# EAGLE schematic 1300XX_3HP_Upgrades (EAGLE 6.5.0)

## Sheet 1 of 4
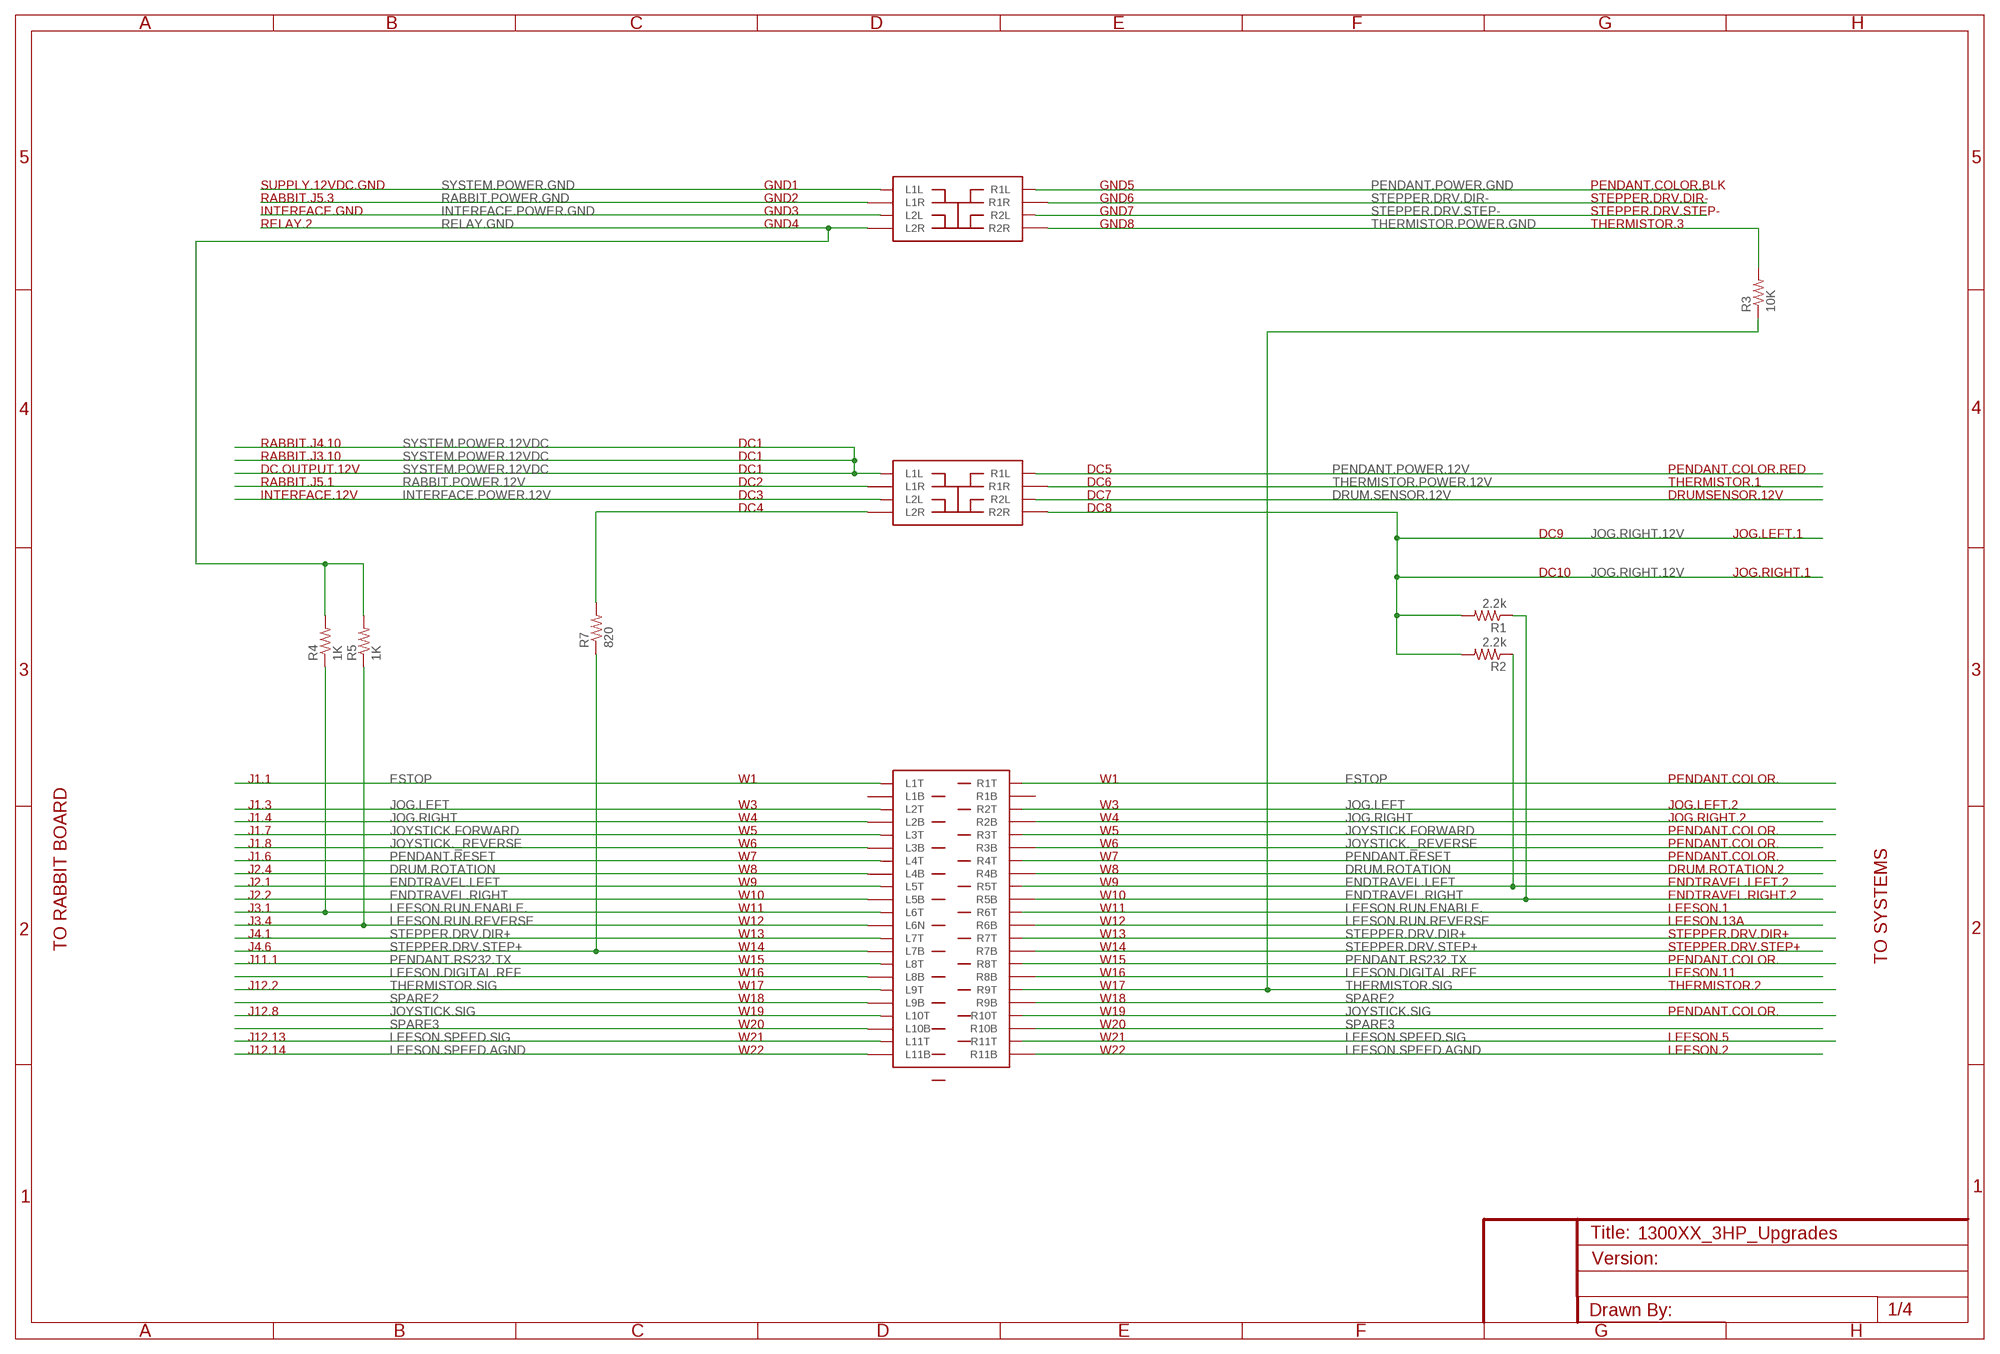
[diagram p0: schematic, sheet 1]

### Parts
R1  2.2k  R-US_V234/12  [V234/12]
R2  2.2k  R-US_V234/12  [V234/12]
R3  10K  R-US_V234/12  [V234/12]
R4  1K  R-US_V234/12  [V234/12]
R5  1K  R-US_V234/12  [V234/12]
R7  820  R-US_V234/12  [V234/12]
U$1  TB_3031160_11POS_DUAL_2  [BOGUS]
U$2  TB_3XXXXXX_4X_2POS  [BOGUS]
U$3  TB_3XXXXXX_4X_2POS  [BOGUS]

### Nets
DRUM.ROTATION: U$1.P$7(L4B) U$1.P$29(R4B)
DRUM.SENSOR.12V: U$2.P$7(R2L)
ENDTRAVEL.LEFT: R2.1 U$1.P$10(L5T) U$1.P$32(R5T)
ENDTRAVEL.RIGHT: R1.1 U$1.P$9(L5B) U$1.P$31(R5B)
ESTOP: U$1.P$2(L1T) U$1.P$24(R1T)
INTERFACE.POWER.12V: U$2.P$3(L2L)
INTERFACE.POWER.GND: U$3.P$3(L2L)
JOG.LEFT: U$1.P$4(L2T) U$1.P$26(R2T)
JOG.RIGHT: U$1.P$3(L2B) U$1.P$25(R2B)
JOG.RIGHT.12V: R1.2 R2.2 U$2.P$8(R2R)
JOYSTICK._REVERSE: U$1.P$5(L3B) U$1.P$27(R3B)
JOYSTICK.FORWARD: U$1.P$6(L3T) U$1.P$28(R3T)
JOYSTICK.SIG: U$1.P$20(L10T) U$1.P$42(R10T)
LEESON.DIGITAL.REF: U$1.P$15(L8B) U$1.P$37(R8B)
LEESON.PULLUPS.12V: R7.2 U$2.P$4(L2R)
LEESON.RUN.ENABLE.: R4.1 U$1.P$12(L6T) U$1.P$34(R6T)
LEESON.RUN.REVERSE: R5.1 U$1.P$11(L6N) U$1.P$33(R6B)
LEESON.SPEED.AGND: U$1.P$21(L11B) U$1.P$43(R11B)
LEESON.SPEED.SIG: U$1.P$22(L11T) U$1.P$44(R11T)
PENDANT.POWER.12V: U$2.P$5(R1L)
PENDANT.POWER.GND: U$3.P$5(R1L)
PENDANT.RESET: U$1.P$8(L4T) U$1.P$30(R4T)
PENDANT.RS232.TX: U$1.P$16(L8T) U$1.P$38(R8T)
RABBIT.POWER.12V: U$2.P$2(L1R)
RABBIT.POWER.GND: U$3.P$2(L1R)
RELAY.GND: R4.2 R5.2 U$3.P$4(L2R)
SPARE2: U$1.P$17(L9B) U$1.P$39(R9B)
SPARE3: U$1.P$19(L10B) U$1.P$41(R10B)
STEPPER.DRV.DIR+: U$1.P$14(L7T) U$1.P$36(R7T)
STEPPER.DRV.DIR-: U$3.P$6(R1R)
STEPPER.DRV.STEP+: R7.1 U$1.P$13(L7B) U$1.P$35(R7B)
STEPPER.DRV.STEP-: U$3.P$7(R2L)
SYSTEM.POWER.12VDC: U$2.P$1(L1L)
SYSTEM.POWER.GND: U$3.P$1(L1L)
THERMISTOR.POWER.12V: U$2.P$6(R1R)
THERMISTOR.POWER.GND: R3.2 U$3.P$8(R2R)
THERMISTOR.SIG: R3.1 U$1.P$18(L9T) U$1.P$40(R9T)
Unconnected: U$1.P$1(L1B) U$1.P$23(R1B)

### Notes on the sheet
- SUPPLY.12VDC.GND | GND1 | GND5 | PENDANT.COLOR.BLK
- RABBIT.J5.3 | GND2 | GND6 | STEPPER.DRV.DIR-
- INTERFACE.GND | GND3 | GND7 | STEPPER.DRV.STEP-
- RELAY.2 | GND4 | GND8 | THERMISTOR.3
- RABBIT.J4.10 | DC1
- RABBIT.J3.10 | DC1
- DC.OUTPUT.12V | DC1 | DC5 | PENDANT.COLOR.RED
- RABBIT.J5.1 | DC2 | DC6 | THERMISTOR.1
- INTERFACE.12V | DC3 | DC7 | DRUMSENSOR.12V
- DC4 | DC8
- DC9 | JOG.LEFT.1
- DC10 | JOG.RIGHT.1
- J1.1 | W1 | W1 | PENDANT.COLOR.
- J1.3 | W3 | W3 | JOG.LEFT.2
- J1.4 | W4 | W4 | JOG.RIGHT.2
- J1.7 | W5 | W5 | PENDANT.COLOR.
- J1.8 | W6 | W6 | PENDANT.COLOR.
- J1.6 | W7 | W7 | PENDANT.COLOR.
- J2.4 | W8 | W8 | DRUM.ROTATION.2
- J2.1 | W9 | W9 | ENDTRAVEL.LEFT.2
- J2.2 | W10 | W10 | ENDTRAVEL.RIGHT.2
- J3.1 | W11 | W11 | LEESON.1
- J3.4 | W12 | W12 | LEESON.13A
- J4.1 | W13 | W13 | STEPPER.DRV.DIR+
- TO RABBIT BOARD | J4.6 | W14 | W14 | STEPPER.DRV.STEP+
- J11.1 | W15 | W15 | PENDANT.COLOR. | TO SYSTEMS
- W16 | W16 | LEESON.11
- J12.2 | W17 | W17 | THERMISTOR.2
- W18 | W18
- J12.8 | W19 | W19 | PENDANT.COLOR.
- W20 | W20
- J12.13 | W21 | W21 | LEESON.5
- J12.14 | W22 | W22 | LEESON.2

## Sheet 2 of 4
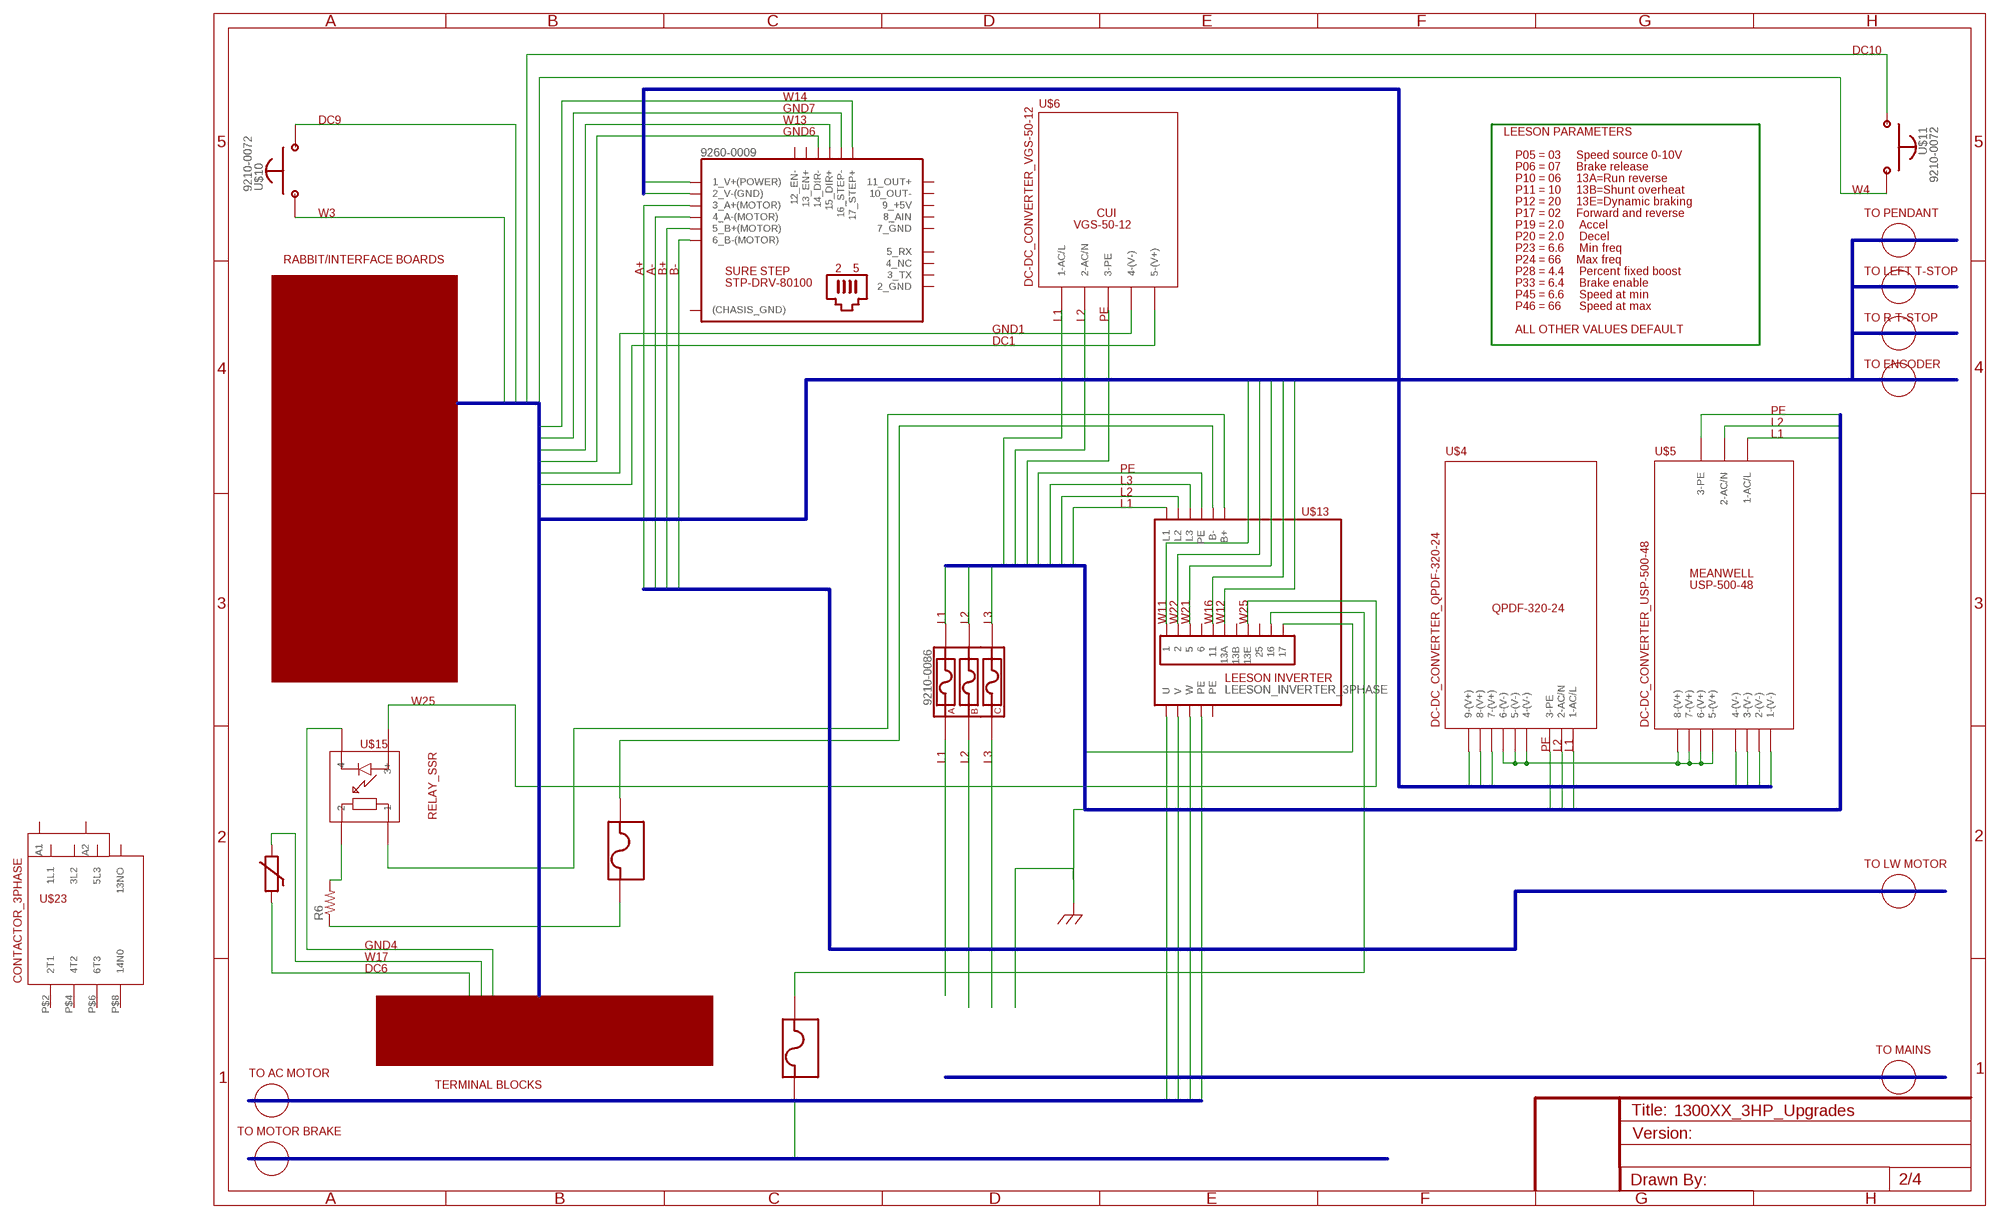
[diagram p1: schematic, sheet 2]

### Parts
PE1  GND_CHASSIS  [BOGUS]
R6  R-US_V234/12  [V234/12]
U$4  DC-DC_CONVERTER_QPDF-320-24  [BOGUS]
U$5  DC-DC_CONVERTER_USP-500-48  [BOGUS]
U$6  DC-DC_CONVERTER_VGS-50-12  [BOGUS]
U$7  THERMISTOR  [BOGUS]
U$8  TERMINAL_BLOCK_FUSED  [BOGUS]
U$9  TERMINAL_BLOCK_FUSED  [BOGUS]
U$10  SWITCH_MOM_NO  [BOGUS]
U$11  SWITCH_MOM_NO  [BOGUS]
U$12  SURE_STEP_STP-DRV-80100  [BOGUS]
U$13  LEESON_INVERTER_3PHASE  [BOGUS]
U$14  FUSE_HOLDER_3-POLE  [BOGUS]
U$15  RELAY_SSR  [BOGUS]
U$23  CONTACTOR_3PHASE  [BOGUS]

### Nets
B$1: PE1.P$1(PE) U$14.P$1 U$14.P$2 U$14.P$5 ; also sheet 4
B$2: U$13.P$18(PE) U$13.P$20(U) U$13.P$21(V) U$13.P$22(W)
B$3: U$8.P$1
B$4: U$4.P$1(1-AC/L) U$4.P$2(2-AC/N) U$4.P$3(3-PE) U$5.P$2(1-AC/L) U$5.P$4(2-AC/N) U$5.P$6(3-PE) U$6.P$1(1-AC/L) U$6.P$2(2-AC/N) U$6.P$3(3-PE) U$13.P$10 U$13.P$14(L1) U$13.P$15(L2) U$13.P$16(L3) U$13.P$17(PE) U$14.P$3 U$14.P$4 U$14.P$6
B$5: U$4.P$7(7-(V+)) U$4.P$8(8-(V+)) U$4.P$9(9-(V+)) U$5.P$1(1-(V-)) U$5.P$3(2-(V-)) U$5.P$5(3-(V-)) U$5.P$7(4-(V-)) U$12.P$2(1_V+(POWER)) U$12.P$3(2_V-(GND))
B$6: U$6.P$4(4-(V-)) U$6.P$5(5-(V+)) U$10.P$1 U$10.P$2 U$11.P$2 U$12.P$15(14_DIR-) U$12.P$16(15_DIR+) U$12.P$17(16_STEP-) U$12.P$18(17_STEP+) U$13.P$1 U$13.P$2 U$13.P$3 U$13.P$5 U$13.P$6(13A)
B$7: U$12.P$4(3_A+(MOTOR)) U$12.P$5(4_A-(MOTOR)) U$12.P$6(5_B+(MOTOR)) U$12.P$7(6_B-(MOTOR))
N$1: U$4.P$4(4-(V-)) U$4.P$5(5-(V-)) U$4.P$6(6-(V-)) U$5.P$8(5-(V+)) U$5.P$9(6-(V+)) U$5.P$10(7-(V+)) U$5.P$11(8-(V+))
N$2: U$9.P$2 U$13.P$13(B-)
N$3: U$13.P$12(B+) U$15.P$1
N$5: R6.2 U$15.P$2
N$6: R6.1 U$9.P$1
N$7: U$13.P$8(13E) U$15.P$3(3+)
N$8: U$8.P$2 U$13.P$9
N$9: U$15.P$4
N$10: U$7.P$1
N$11: U$7.P$2
Unconnected: U$11.P$1 U$13.P$4 U$13.P$7(13B) U$13.P$11 U$23.P$1(1L1) U$23.P$2(2T1) U$23.P$3(3L2) U$23.P$4(4T2) U$23.P$5(5L3) U$23.P$6(6T3) U$23.P$7(13NO) U$23.P$8(14N0) U$23.P$9(A1) U$23.P$10(A2)

### Buses
B$1
B$2
B$3
B$4
B$5
B$6
B$7

### Notes on the sheet
- DC10
- W14
- GND7
- DC9 | W13
- GND6 | LEESON PARAMETERS
- P05 = 03     Speed source 0-10V
- P06 = 07     Brake release
- P10 = 06     13A=Run reverse
- P11 = 10     13B=Shunt overheat | W4
- P12 = 20     13E=Dynamic braking
- W3 | P17 = 02     Forward and reverse | TO PENDANT
- P19 = 2.0     Accel
- P20 = 2.0     Decel
- P23 = 6.6     Min freq
- RABBIT/INTERFACE BOARDS | P24 = 66     Max freq
- A+ | A- | B+ | B- | P28 = 4.4     Percent fixed boost | TO LEFT T-STOP
- P33 = 6.4     Brake enable
- P45 = 6.6     Speed at min
- P46 = 66      Speed at max
- L1 | L2 | PE | TO R T-STOP
- GND1 | ALL OTHER VALUES DEFAULT
- DC1
- TO ENCODER
- PE
- L2
- L1
- PE
- L3
- L2
- L1
- L1 | L2 | L3 | W11 | W22 | W21 | W16 | W12 | W25
- W25
- PE | L2 | L1
- L1 | L2 | L3
- TO LW MOTOR
- GND4
- W17
- DC6
- TO MAINS
- TO AC MOTOR
- TERMINAL BLOCKS
- TO MOTOR BRAKE

## Sheet 3 of 4
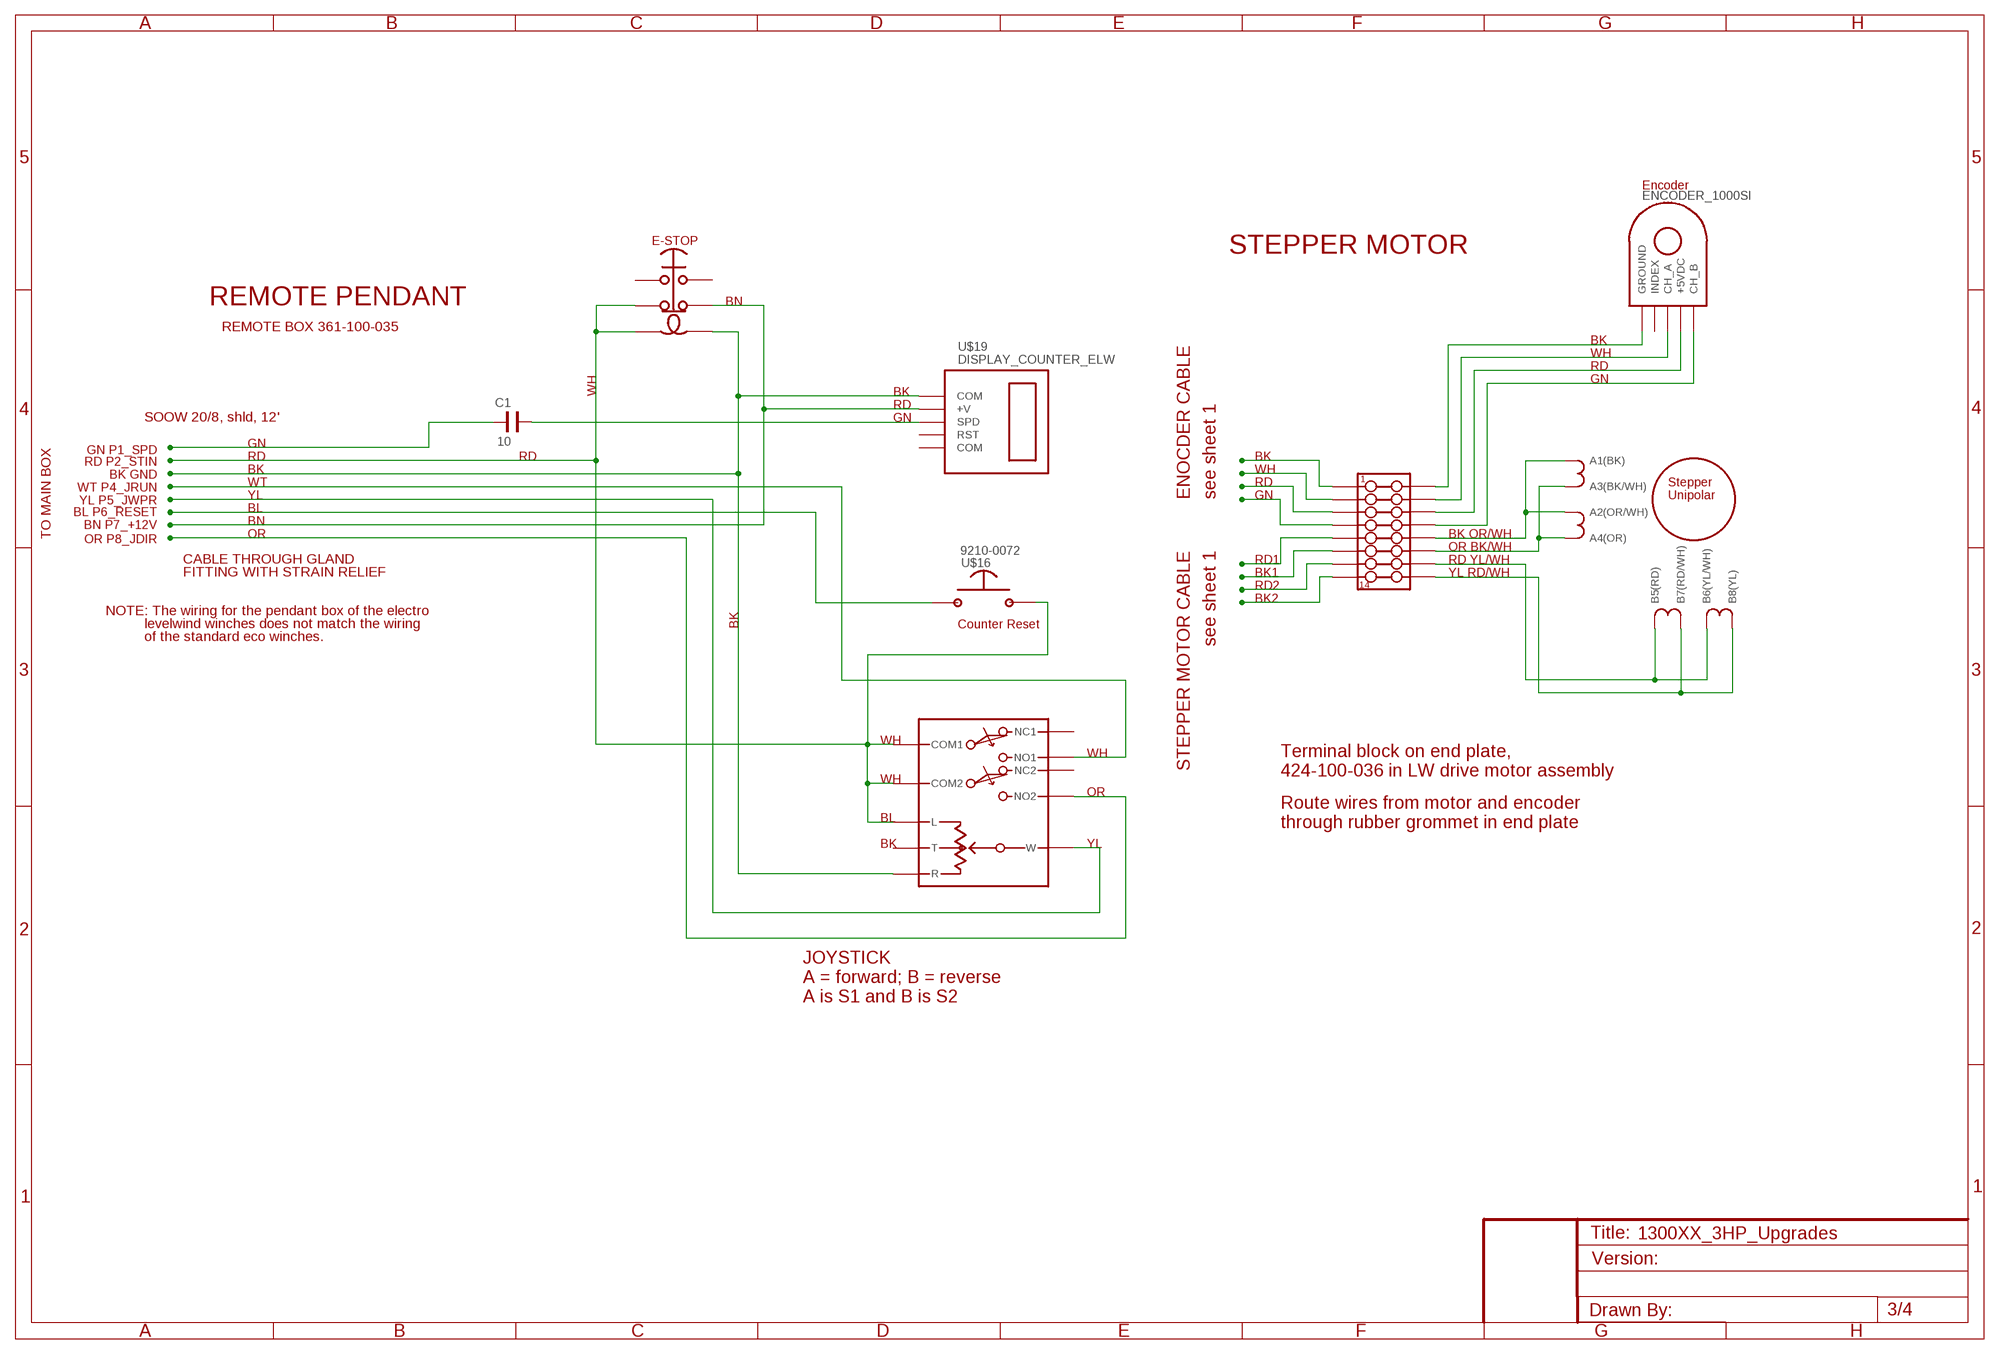
[diagram p2: schematic, sheet 3]

### Parts
C1  10  C0805  [R0805]
U$16  Counter Reset  SWITCH_MOM_NO  [BOGUS]
U$17  SWITCH_ESTOP_LIGHTED  [BOGUS]
U$18  JOYSTICK_PRO-5  [BOGUS]
U$19  DISPLAY_COUNTER_ELW  [BOGUS]
U$20  TERMINAL_BLOCK_8  [BOGUS]
U$21  MOTOR_STEPPER_UNIPOLAR  [BOGUS]
U$22  ENCODER_1000SI  [BOGUS]

### Nets
N$4: U$17.P$6 U$18.P$8(R) U$19.P$2(COM)
N$23: C1.2 U$19.P$5(SPD)
N$69: C1.1
N$72: U$18.P$6(NO1)
N$73: U$18.P$10(W)
N$75: U$17.P$4 U$19.P$1(+V)
N$76: U$18.P$7(NO2)
N$77: U$16.P$1
N$78: U$16.P$2 U$17.P$2 U$17.P$5 U$18.P$1(COM1) U$18.P$2(COM2) U$18.P$3(L)
N$81: U$20.P$12 U$21.P$1(A1(BK)) U$21.P$2(A2(OR/WH))
N$88: U$20.P$11 U$21.P$3(A3(BK/WH)) U$21.P$4(A4(OR))
N$89: U$20.P$9 U$21.P$7(B7(RD/WH)) U$21.P$8(B8(YL))
N$91: U$20.P$10 U$21.P$5(B5(RD)) U$21.P$6(B6(YL/WH))
N$92: U$20.P$16 U$22.P$4(GROUND)
N$93: U$20.P$15 U$22.P$2(CH_A)
N$94: U$20.P$14 U$22.P$1(+5VDC)
N$95: U$20.P$13 U$22.P$3(CH_B)
N$96: U$20.P$1
N$97: U$20.P$2
N$98: U$20.P$3
N$99: U$20.P$4
N$100: U$20.P$8
N$101: U$20.P$7
N$102: U$20.P$6
N$103: U$20.P$5
Unconnected: U$17.P$1 U$17.P$3 U$18.P$4(NC1) U$18.P$5(NC2) U$18.P$9(T) U$19.P$3(COM) U$19.P$4(RST) U$22.P$5(INDEX)

### Notes on the sheet
- STEPPER MOTOR
- REMOTE PENDANT | BN
- REMOTE BOX 361-100-035
- BK
- WH
- RD
- GN
- WH | BK
- RD
- SOOW 20/8, shld, 12' | GN
- TO MAIN BOX | GN P1_SPD | GN
- RD P2_STIN
- RD | RD | BK
- BK GND
- BK | WH
- WT P4_JRUN
- WT | RD
- YL P5_JWPR
- YL | ENOCDER CABLE | see sheet 1 | GN
- BL P6_RESET
- BL
- BN P7_+12V
- BN
- OR P8_JDIR
- OR | BK OR/WH
- STEPPER MOTOR CABLE | see sheet 1 | OR BK/WH
- CABLE THROUGH GLAND | RD1 | RD YL/WH
- FITTING WITH STRAIN RELIEF | BK1 | YL RD/WH
- RD2
- BK2
- NOTE: The wiring for the pendant box of the electro
- levelwind winches does not match the wiring | BK | Counter Reset
- of the standard eco winches.
- WH
- WH | Terminal block on end plate,
- 424-100-036 in LW drive motor assembly
- WH
- OR
- Route wires from motor and encoder
- BL
- through rubber grommet in end plate
- BK | YL
- JOYSTICK
- A = forward; B = reverse
- A is S1 and B is S2

## Sheet 4 of 4
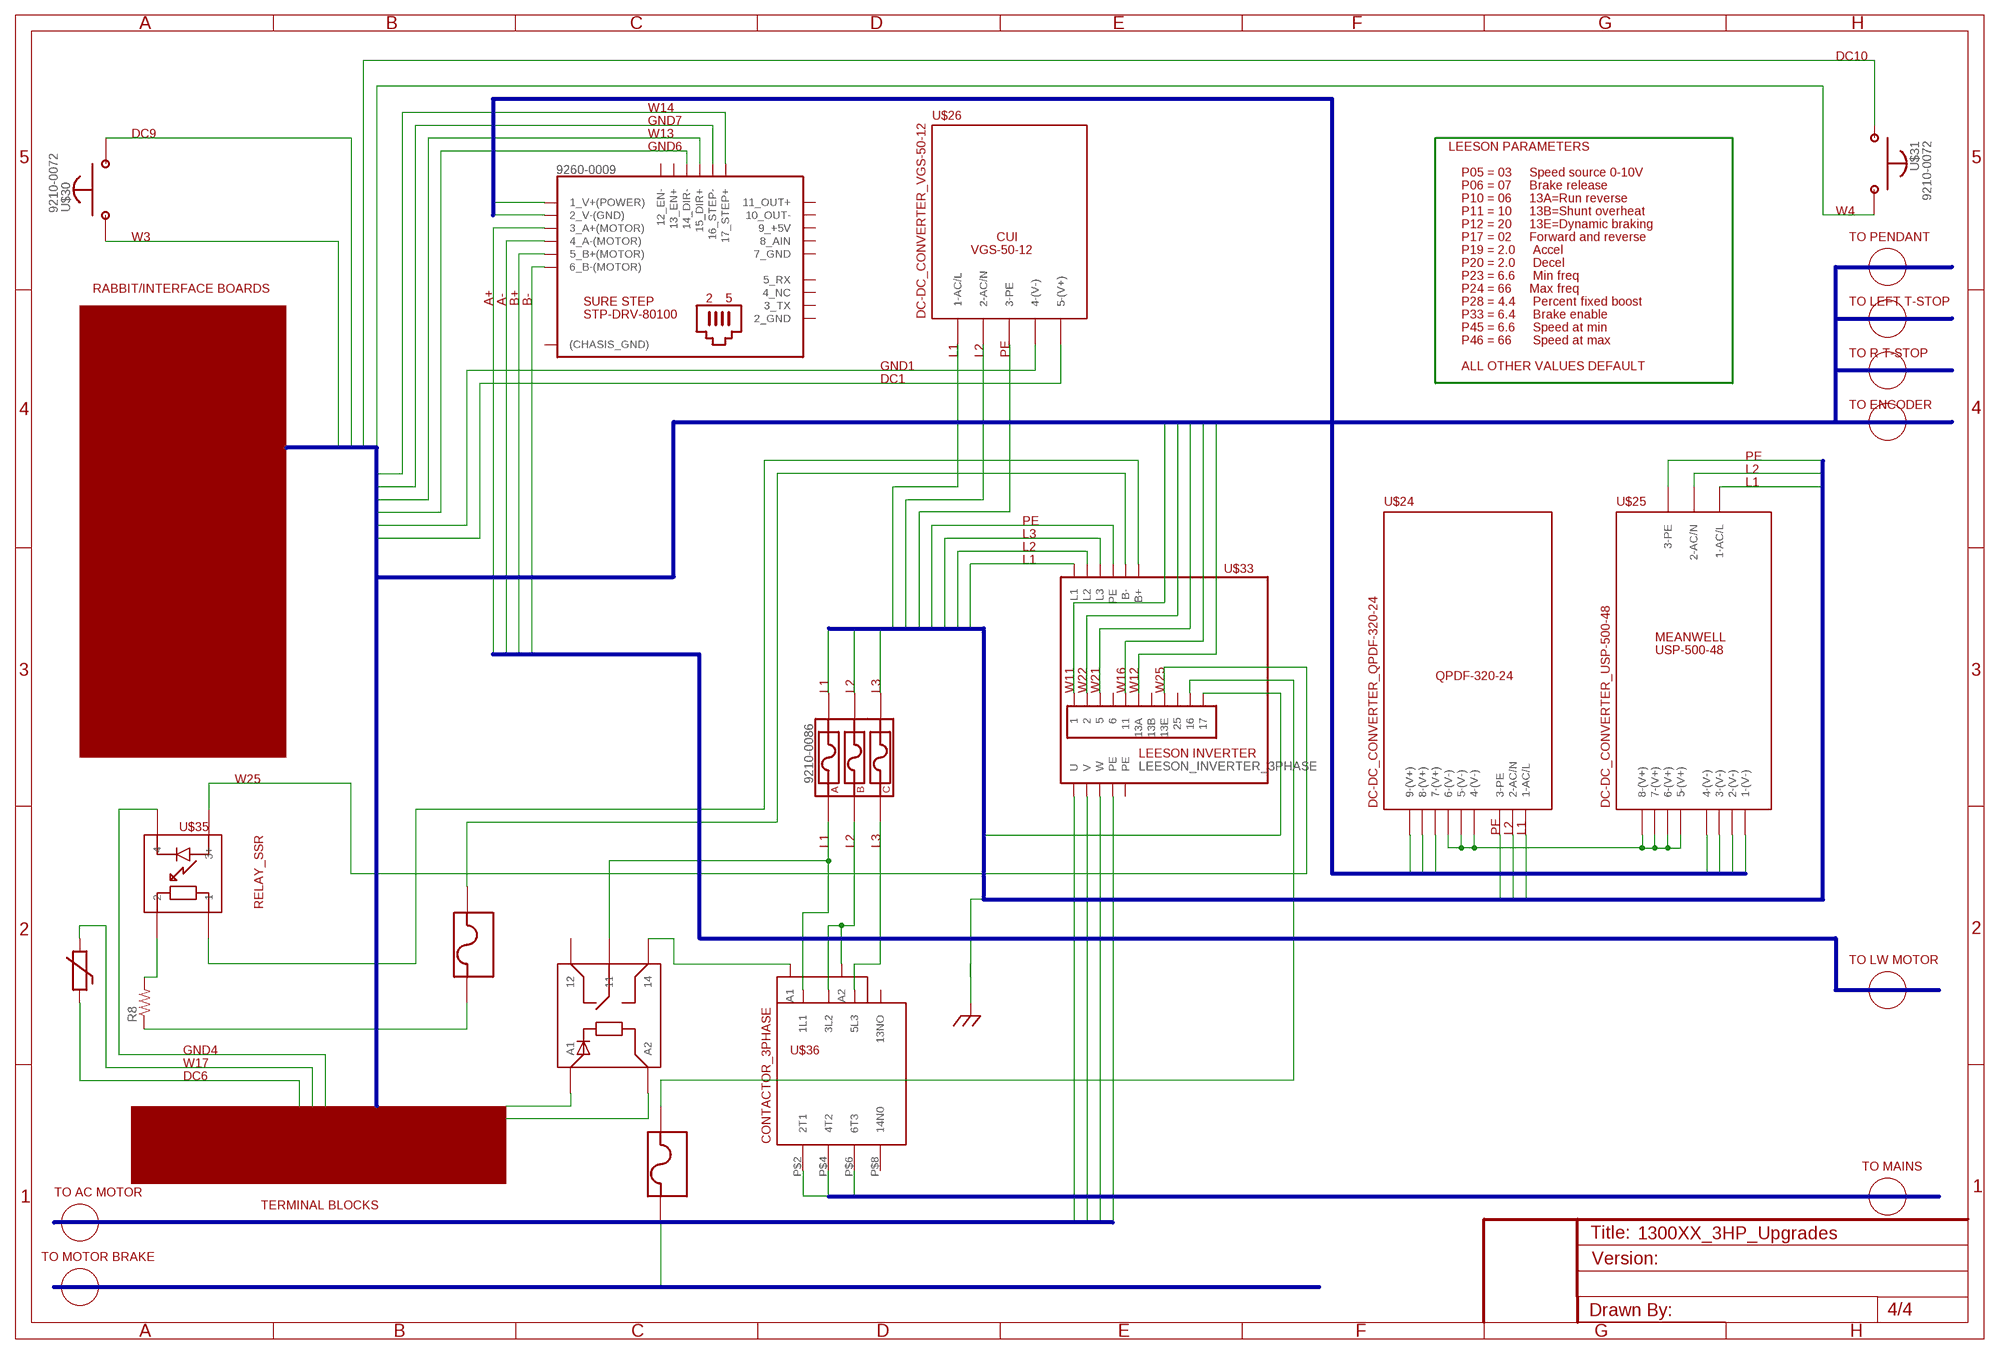
[diagram p3: schematic, sheet 4]

### Parts
PE2  GND_CHASSIS  [BOGUS]
R8  R-US_V234/12  [V234/12]
U$24  DC-DC_CONVERTER_QPDF-320-24  [BOGUS]
U$25  DC-DC_CONVERTER_USP-500-48  [BOGUS]
U$26  DC-DC_CONVERTER_VGS-50-12  [BOGUS]
U$27  THERMISTOR  [BOGUS]
U$28  TERMINAL_BLOCK_FUSED  [BOGUS]
U$29  TERMINAL_BLOCK_FUSED  [BOGUS]
U$30  SWITCH_MOM_NO  [BOGUS]
U$31  SWITCH_MOM_NO  [BOGUS]
U$32  SURE_STEP_STP-DRV-80100  [BOGUS]
U$33  LEESON_INVERTER_3PHASE  [BOGUS]
U$34  FUSE_HOLDER_3-POLE  [BOGUS]
U$35  RELAY_SSR  [BOGUS]
U$36  CONTACTOR_3PHASE  [BOGUS]
U$37  RELAY_TB  [BOGUS]

### Nets
B$1: PE2.P$1(PE) U$36.P$2(2T1) U$36.P$4(4T2) U$36.P$6(6T3) ; also sheet 2
B$8: U$33.P$18(PE) U$33.P$20(U) U$33.P$21(V) U$33.P$22(W)
B$9: U$24.P$1(1-AC/L) U$24.P$2(2-AC/N) U$24.P$3(3-PE) U$25.P$2(1-AC/L) U$25.P$4(2-AC/N) U$25.P$6(3-PE) U$26.P$1(1-AC/L) U$26.P$2(2-AC/N) U$26.P$3(3-PE) U$33.P$10 U$33.P$14(L1) U$33.P$15(L2) U$33.P$16(L3) U$33.P$17(PE) U$34.P$3 U$34.P$4 U$34.P$6
B$10: U$24.P$7(7-(V+)) U$24.P$8(8-(V+)) U$24.P$9(9-(V+)) U$25.P$1(1-(V-)) U$25.P$3(2-(V-)) U$25.P$5(3-(V-)) U$25.P$7(4-(V-)) U$32.P$2(1_V+(POWER)) U$32.P$3(2_V-(GND))
B$11: U$26.P$4(4-(V-)) U$26.P$5(5-(V+)) U$30.P$1 U$30.P$2 U$31.P$2 U$32.P$15(14_DIR-) U$32.P$16(15_DIR+) U$32.P$17(16_STEP-) U$32.P$18(17_STEP+) U$33.P$1 U$33.P$2 U$33.P$3 U$33.P$5 U$33.P$6(13A)
B$12: U$28.P$1
B$13: U$32.P$4(3_A+(MOTOR)) U$32.P$5(4_A-(MOTOR)) U$32.P$6(5_B+(MOTOR)) U$32.P$7(6_B-(MOTOR))
N$12: U$24.P$4(4-(V-)) U$24.P$5(5-(V-)) U$24.P$6(6-(V-)) U$25.P$8(5-(V+)) U$25.P$9(6-(V+)) U$25.P$10(7-(V+)) U$25.P$11(8-(V+))
N$13: U$29.P$2 U$33.P$13(B-)
N$14: U$33.P$12(B+) U$35.P$1
N$15: R8.2 U$35.P$2
N$16: R8.1 U$29.P$1
N$17: U$28.P$2 U$33.P$9
N$18: U$33.P$8(13E) U$35.P$3(3+)
N$19: U$35.P$4
N$20: U$27.P$1
N$21: U$27.P$2
N$25: U$34.P$5 U$36.P$5(5L3)
N$26: U$34.P$1 U$36.P$3(3L2) U$36.P$10(A2)
N$27: U$34.P$2 U$36.P$1(1L1) U$37.P$1
N$28: U$37.P$5(A2)
N$29: U$37.P$4(A1)
N$30: U$36.P$9(A1) U$37.P$3
Unconnected: U$31.P$1 U$33.P$4 U$33.P$7(13B) U$33.P$11 U$36.P$7(13NO) U$36.P$8(14N0) U$37.P$2

### Buses
B$1
B$2
B$3
B$4
B$5
B$6
B$7

### Notes on the sheet
- DC10
- W14
- GND7
- DC9 | W13
- GND6 | LEESON PARAMETERS
- P05 = 03     Speed source 0-10V
- P06 = 07     Brake release
- P10 = 06     13A=Run reverse
- P11 = 10     13B=Shunt overheat | W4
- P12 = 20     13E=Dynamic braking
- W3 | P17 = 02     Forward and reverse | TO PENDANT
- P19 = 2.0     Accel
- P20 = 2.0     Decel
- P23 = 6.6     Min freq
- RABBIT/INTERFACE BOARDS | P24 = 66     Max freq
- A+ | A- | B+ | B- | P28 = 4.4     Percent fixed boost | TO LEFT T-STOP
- P33 = 6.4     Brake enable
- P45 = 6.6     Speed at min
- P46 = 66      Speed at max
- L1 | L2 | PE | TO R T-STOP
- GND1 | ALL OTHER VALUES DEFAULT
- DC1
- TO ENCODER
- PE
- L2
- L1
- PE
- L3
- L2
- L1
- L1 | L2 | L3 | W11 | W22 | W21 | W16 | W12 | W25
- W25
- PE | L2 | L1
- L1 | L2 | L3
- TO LW MOTOR
- GND4
- W17
- DC6
- TO MAINS
- TO AC MOTOR
- TERMINAL BLOCKS
- TO MOTOR BRAKE

## Power pins joined to a net without a drawn wire
2_GND: U$12.P$19(2_GND) U$32.P$19(2_GND)
3_TX: U$12.P$20(3_TX) U$32.P$20(3_TX)
4_NC: U$12.P$21(4_NC) U$32.P$21(4_NC)
5_RX: U$12.P$22(5_RX) U$32.P$22(5_RX)
7_GND: U$12.P$8(7_GND) U$32.P$8(7_GND)
8_AIN: U$12.P$9(8_AIN) U$32.P$9(8_AIN)
9_+5V: U$12.P$10(9_+5V) U$32.P$10(9_+5V)
10_OUT-: U$12.P$11(10_OUT-) U$32.P$11(10_OUT-)
11_OUT+: U$12.P$12(11_OUT+) U$32.P$12(11_OUT+)
12_EN-: U$12.P$13(12_EN-) U$32.P$13(12_EN-)
13_EN+: U$12.P$14(13_EN+) U$32.P$14(13_EN+)
(CHASIS_GND): U$12.P$1((CHASIS_GND)) U$32.P$1((CHASIS_GND))
PE: U$13.P$19(PE) U$33.P$19(PE)

## Library data of the parts
C1 = SOSI:C0805; DPN: 10009
PE1 PE2 = DougM-SOSI-Wiring-Diagram.rpt:GND_CHASSIS: SUPPLY SYMBOL
R1-R5 R7 = rcl:R-US_: RESISTOR, American symbol
R6 R8 = resistor:R-US_: RESISTOR, American symbol
U$1 = SOSI-TerminalBlocks:TB_3031160_11POS_DUAL_2
U$2 U$3 = SOSI-TerminalBlocks:TB_3XXXXXX_4X_2POS
U$4 U$24 = DougM-SOSI-Wiring-Diagram.rpt:DC-DC_CONVERTER_QPDF-320-24
U$5 U$25 = DougM-SOSI-Wiring-Diagram.rpt:DC-DC_CONVERTER_USP-500-48
U$6 U$26 = DougM-SOSI-Wiring-Diagram.rpt:DC-DC_CONVERTER_VGS-50-12
U$7 U$27 = DougM-SOSI-Wiring-Diagram.rpt:THERMISTOR: (no PN available) (no description available) Soundnine Inc. (no vendor PN available)
U$8 U$9 U$28 U$29 = DougM-SOSI-Wiring-Diagram.rpt:TERMINAL_BLOCK_FUSED: 9210-0372 7641K943 Modular DIN Rail-Mount Terminal Block DIN 1 & 3, w/ Blown Fuse Indicator, 8mm, 24 VDC McMasterr McMaster 7641K943
U$10 U$11 U$30 U$31 = DougM-SOSI-Wiring-Diagram.rpt:SWITCH_MOM_NO: 9210-0072 Mouser Part #: 850-59-313 Manufacturer Part #: 59-313
U$12 U$32 = DougM-SOSI-Wiring-Diagram.rpt:SURE_STEP_STP-DRV-80100: 9260-0009 STP-DRV-80100 Step Motor Driver, 80 V 10A Sure Step Automation Direct
U$13 U$33 = DougM-SOSI-Wiring-Diagram.rpt:LEESON_INVERTER_3PHASE
U$14 U$34 = DougM-SOSI-Wiring-Diagram.rpt:FUSE_HOLDER_3-POLE: 9210-0086 BC6033PQ Fuseholder, Class CC & Class G, 3 pole, 600V, 30A, for 13/32x1 1/2 fuses Cooper/Bussman North Coast Electric
U$15 U$35 = DougM-SOSI-Wiring-Diagram.rpt:RELAY_SSR
U$16 = DougM-SOSI-Wiring-Diagram:SWITCH_MOM_NO: 9210-0072 Mouser Part #: 850-59-313 Manufacturer Part #: 59-313
U$17 = DougM-SOSI-Wiring-Diagram:SWITCH_ESTOP_LIGHTED: 9210-0045 Switch, Emergency Stop, w/ #800T-XA4 contact block (old #800H-FRXTQH10RA4) Allen Bradley 800H-FRXTQH2RA4
U$18 = DougM-SOSI-Wiring-Diagram:JOYSTICK_PRO-5: 9280-0000 PRO5-202.1085 (w/20k center tap potentiometer) Joystick (Master Switch), w/20k center tap potentiometer J. R. Merritt Controls
U$19 = DougM-SOSI-Wiring-Diagram:DISPLAY_COUNTER_ELW: 9215-0003 12062A-1 Display Board Assy., ECO-ELW line speed/counter Soundnine Inc.
U$20 = DougM-SOSI-Wiring-Diagram:TERMINAL_BLOCK_8: 9210-0073 ESO800/08DSFB CONN TERMINAL STRIP 8MM 8CIRC On Shore Technology Inc Digi-Key ED2999-ND
U$21 = DougM-SOSI-Wiring-Diagram:MOTOR_STEPPER_UNIPOLAR: 9500-0016 34Y214D-LW8-1000SI Stepper Motor with 1000 line encoder Anaheim Automation Kaman Industrial Technologies
U$22 = DougM-SOSI-Wiring-Diagram:ENCODER_1000SI: (no PN) 1000SI Single-Ended Encoder with Index Channel (comes as part of Stepper Motor assembly 9500-0016) Anaheim Automation
U$23 U$36 = DougM-SOSI-Wiring-Diagram.rpt:CONTACTOR_3PHASE
U$37 = DougM-SOSI-Wiring-Diagram.rpt:RELAY_TB